# EAGLE design base-6u-custom-8535 (EAGLE 6.2)
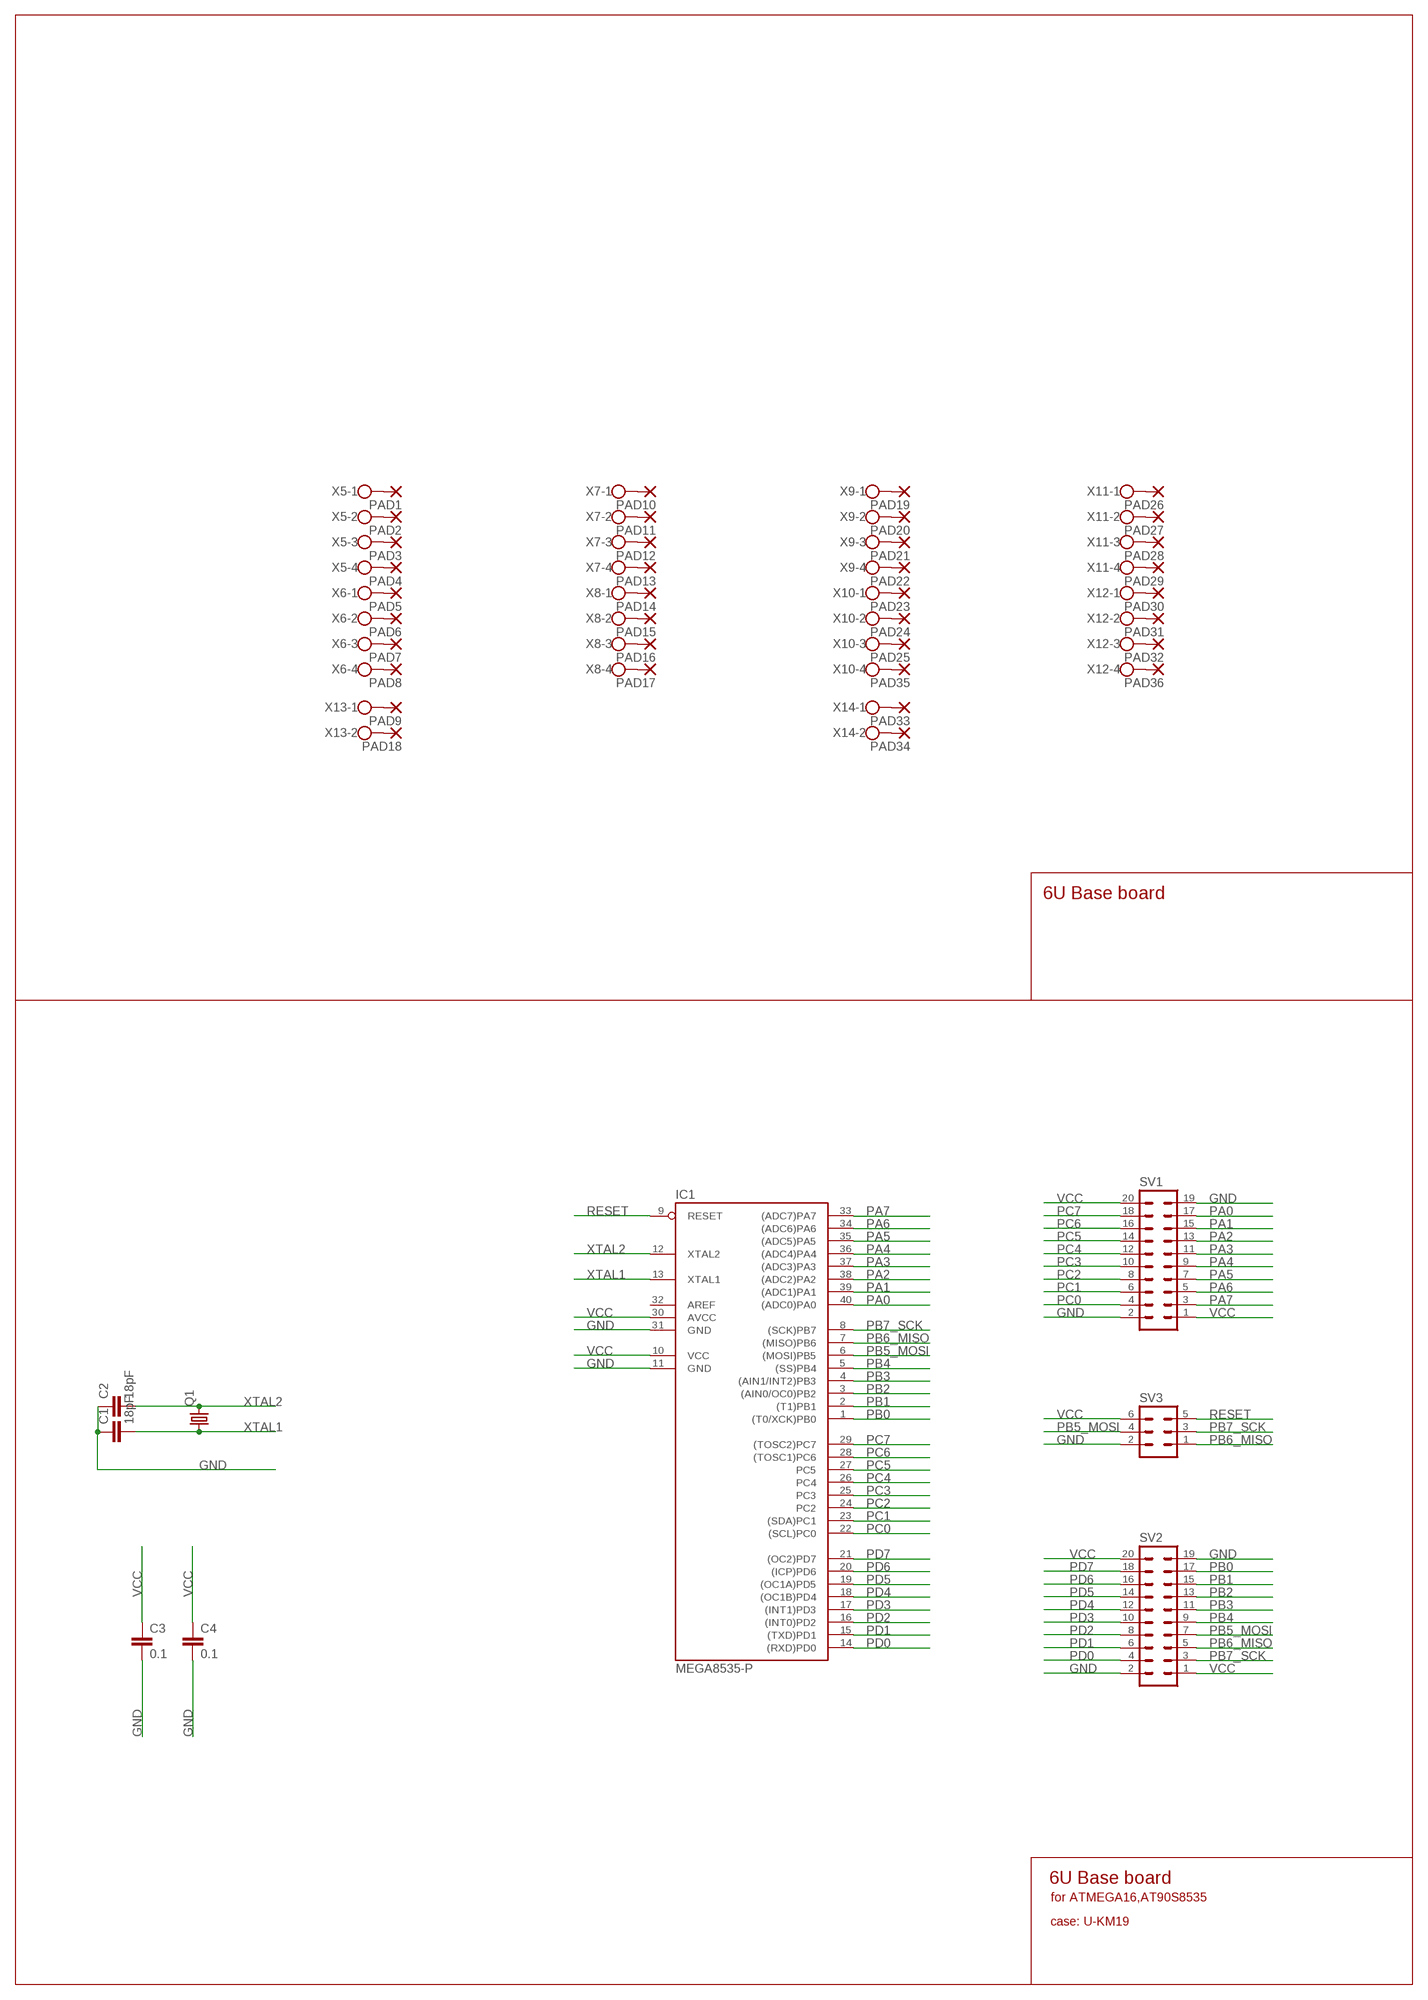
[diagram p0: schematic, sheet 1]

## Parts
C1  18pF  C-EUC0805  [C0805]
C2  18pF  C-EUC0805  [C0805]
C3  0.1  C-EUC0805  [C0805]
C4  0.1  C-EUC0805  [C0805]
IC1  MEGA8535-P  [DIL40]
PAD1  2,54/0,8  [2,54/0,8]
PAD2  2,54/0,8  [2,54/0,8]
PAD3  2,54/0,8  [2,54/0,8]
PAD4  2,54/0,8  [2,54/0,8]
PAD5  2,54/0,8  [2,54/0,8]
PAD6  2,54/0,8  [2,54/0,8]
PAD7  2,54/0,8  [2,54/0,8]
PAD8  2,54/0,8  [2,54/0,8]
PAD9  2,54/0,8  [2,54/0,8]
PAD10  2,54/0,8  [2,54/0,8]
PAD11  2,54/0,8  [2,54/0,8]
PAD12  2,54/0,8  [2,54/0,8]
PAD13  2,54/0,8  [2,54/0,8]
PAD14  2,54/0,8  [2,54/0,8]
PAD15  2,54/0,8  [2,54/0,8]
PAD16  2,54/0,8  [2,54/0,8]
PAD17  2,54/0,8  [2,54/0,8]
PAD18  2,54/0,8  [2,54/0,8]
PAD19  2,54/0,8  [2,54/0,8]
PAD20  2,54/0,8  [2,54/0,8]
PAD21  2,54/0,8  [2,54/0,8]
PAD22  2,54/0,8  [2,54/0,8]
PAD23  2,54/0,8  [2,54/0,8]
PAD24  2,54/0,8  [2,54/0,8]
PAD25  2,54/0,8  [2,54/0,8]
PAD26  2,54/0,8  [2,54/0,8]
PAD27  2,54/0,8  [2,54/0,8]
PAD28  2,54/0,8  [2,54/0,8]
PAD29  2,54/0,8  [2,54/0,8]
PAD30  2,54/0,8  [2,54/0,8]
PAD31  2,54/0,8  [2,54/0,8]
PAD32  2,54/0,8  [2,54/0,8]
PAD33  2,54/0,8  [2,54/0,8]
PAD34  2,54/0,8  [2,54/0,8]
PAD35  2,54/0,8  [2,54/0,8]
PAD36  2,54/0,8  [2,54/0,8]
Q1  CRYSTALHC49S  [HC49/S]
SV1  MA10-2  [MA10-2]
SV2  MA10-2  [MA10-2]
SV3  MA03-2  [MA03-2]
X5  W237-4  [W237-4]
X6  W237-4  [W237-4]
X7  W237-4  [W237-4]
X8  W237-4  [W237-4]
X9  W237-4  [W237-4]
X10  W237-4  [W237-4]
X11  W237-4  [W237-4]
X12  W237-4  [W237-4]
X13  W237-102  [W237-102]
X14  W237-102  [W237-102]

## Nets
GND: C1.1 C2.1 C3.2 C4.2 IC1.11(GND) IC1.31(GND) SV1.2 SV1.19 SV2.2 SV2.19 SV3.2
N$1: PAD1.1(P) X5.1
N$2: PAD2.1(P) X5.2
N$3: PAD3.1(P) X5.3
N$4: PAD4.1(P) X5.4
N$5: PAD5.1(P) X6.1
N$6: PAD6.1(P) X6.2
N$7: PAD7.1(P) X6.3
N$8: PAD8.1(P) X6.4
N$9: PAD9.1(P) X13.1
N$10: PAD10.1(P) X7.1
N$11: PAD11.1(P) X7.2
N$12: PAD12.1(P) X7.3
N$13: PAD13.1(P) X7.4
N$14: PAD14.1(P) X8.1
N$15: PAD15.1(P) X8.2
N$16: PAD16.1(P) X8.3
N$17: PAD17.1(P) X8.4
N$18: PAD18.1(P) X13.2
N$19: PAD26.1(P) X11.1
N$20: PAD27.1(P) X11.2
N$21: PAD28.1(P) X11.3
N$22: PAD29.1(P) X11.4
N$23: PAD30.1(P) X12.1
N$24: PAD31.1(P) X12.2
N$25: PAD32.1(P) X12.3
N$26: PAD19.1(P) X9.1
N$27: PAD20.1(P) X9.2
N$28: PAD21.1(P) X9.3
N$29: PAD22.1(P) X9.4
N$30: PAD23.1(P) X10.1
N$31: PAD24.1(P) X10.2
N$32: PAD25.1(P) X10.3
N$33: PAD35.1(P) X10.4
N$34: PAD36.1(P) X12.4
N$35: PAD33.1(P) X14.1
N$36: PAD34.1(P) X14.2
PA0: IC1.40((ADC0)PA0) SV1.17
PA1: IC1.39((ADC1)PA1) SV1.15
PA2: IC1.38((ADC2)PA2) SV1.13
PA3: IC1.37((ADC3)PA3) SV1.11
PA4: IC1.36((ADC4)PA4) SV1.9
PA5: IC1.35((ADC5)PA5) SV1.7
PA6: IC1.34((ADC6)PA6) SV1.5
PA7: IC1.33((ADC7)PA7) SV1.3
PB0: IC1.1((T0/XCK)PB0) SV2.17
PB1: IC1.2((T1)PB1) SV2.15
PB2: IC1.3((AIN0/OC0)PB2) SV2.13
PB3: IC1.4((AIN1/INT2)PB3) SV2.11
PB4: IC1.5((SS)PB4) SV2.9
PB5_MOSI: IC1.6((MOSI)PB5) SV2.7 SV3.4
PB6_MISO: IC1.7((MISO)PB6) SV2.5 SV3.1
PB7_SCK: IC1.8((SCK)PB7) SV2.3 SV3.3
PC0: IC1.22((SCL)PC0) SV1.4
PC1: IC1.23((SDA)PC1) SV1.6
PC2: IC1.24(PC2) SV1.8
PC3: IC1.25(PC3) SV1.10
PC4: IC1.26(PC4) SV1.12
PC5: IC1.27(PC5) SV1.14
PC6: IC1.28((TOSC1)PC6) SV1.16
PC7: IC1.29((TOSC2)PC7) SV1.18
PD0: IC1.14((RXD)PD0) SV2.4
PD1: IC1.15((TXD)PD1) SV2.6
PD2: IC1.16((INT0)PD2) SV2.8
PD3: IC1.17((INT1)PD3) SV2.10
PD4: IC1.18((OC1B)PD4) SV2.12
PD5: IC1.19((OC1A)PD5) SV2.14
PD6: IC1.20((ICP)PD6) SV2.16
PD7: IC1.21((OC2)PD7) SV2.18
RESET: IC1.9(RESET) SV3.5
VCC: C3.1 C4.1 IC1.10(VCC) IC1.30(AVCC) SV1.1 SV1.20 SV2.1 SV2.20 SV3.6
XTAL1: C1.2 IC1.13(XTAL1) Q1.1
XTAL2: C2.2 IC1.12(XTAL2) Q1.2
Unconnected: IC1.32(AREF)

## Notes on the sheet
- 6U Base board
- 6U Base board
- for ATMEGA16,AT90S8535
- case: U-KM19

## Library data of the parts
C1-C4 = rcl:C-EU: CAPACITOR, European symbol
IC1 = atmel:MEGA8535-P: MICROCONTROLLER 8 Kbytes FLASH 512 bytes SRAM 512 bytes EEPROM USART 8-channel 10 bit ADC Source: avr.lbr; MPN: ATMEGA8535-16PU; OC_FARNELL: 9171444; OC_NEWARK: 01M6909
PAD1-PAD36 = wirepad:2,54/0,8: THROUGH-HOLE PAD
Q1 = crystal:CRYSTAL: CRYSTAL
SV1 SV2 = con-lstb:MA10-2: PIN HEADER; OC_FARNELL: unknown; OC_NEWARK: unknown
SV3 = con-lstb:MA03-2: PIN HEADER; OC_FARNELL: unknown; OC_NEWARK: unknown
X5-X12 = con-wago-500:W237-4: WAGO SCREW CLAMP; OC_FARNELL: unknown; OC_NEWARK: unknown
X13 X14 = con-wago-500:W237-102: WAGO SCREW CLAMP; MPN: 237-102; OC_FARNELL: unknown; OC_NEWARK: 70K9898

## Board
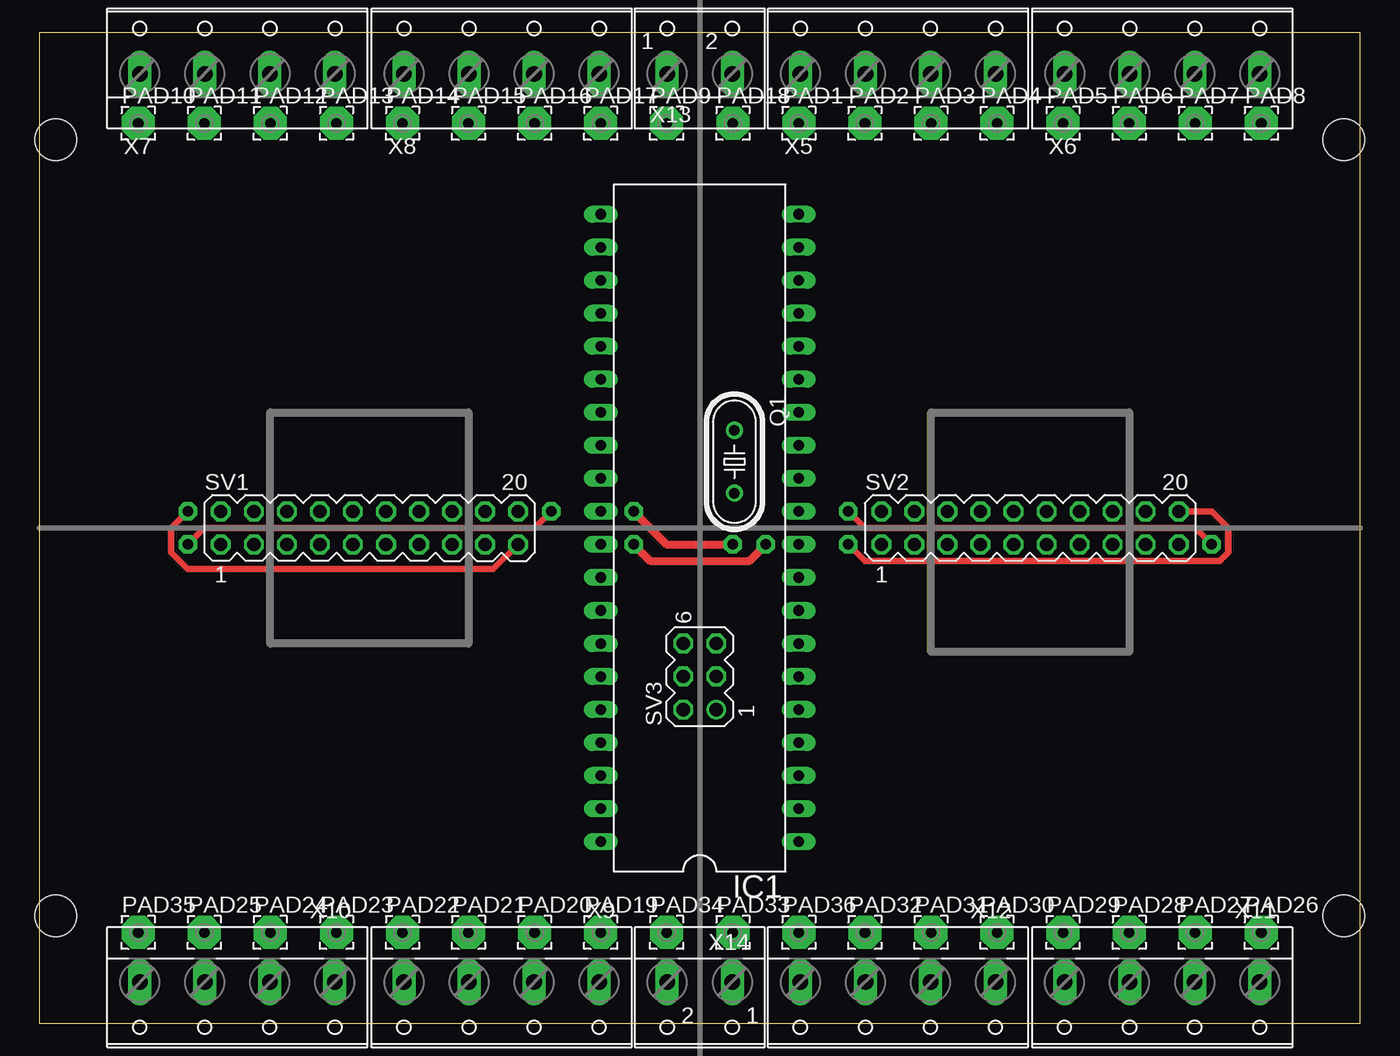
[diagram p1: board, top side]
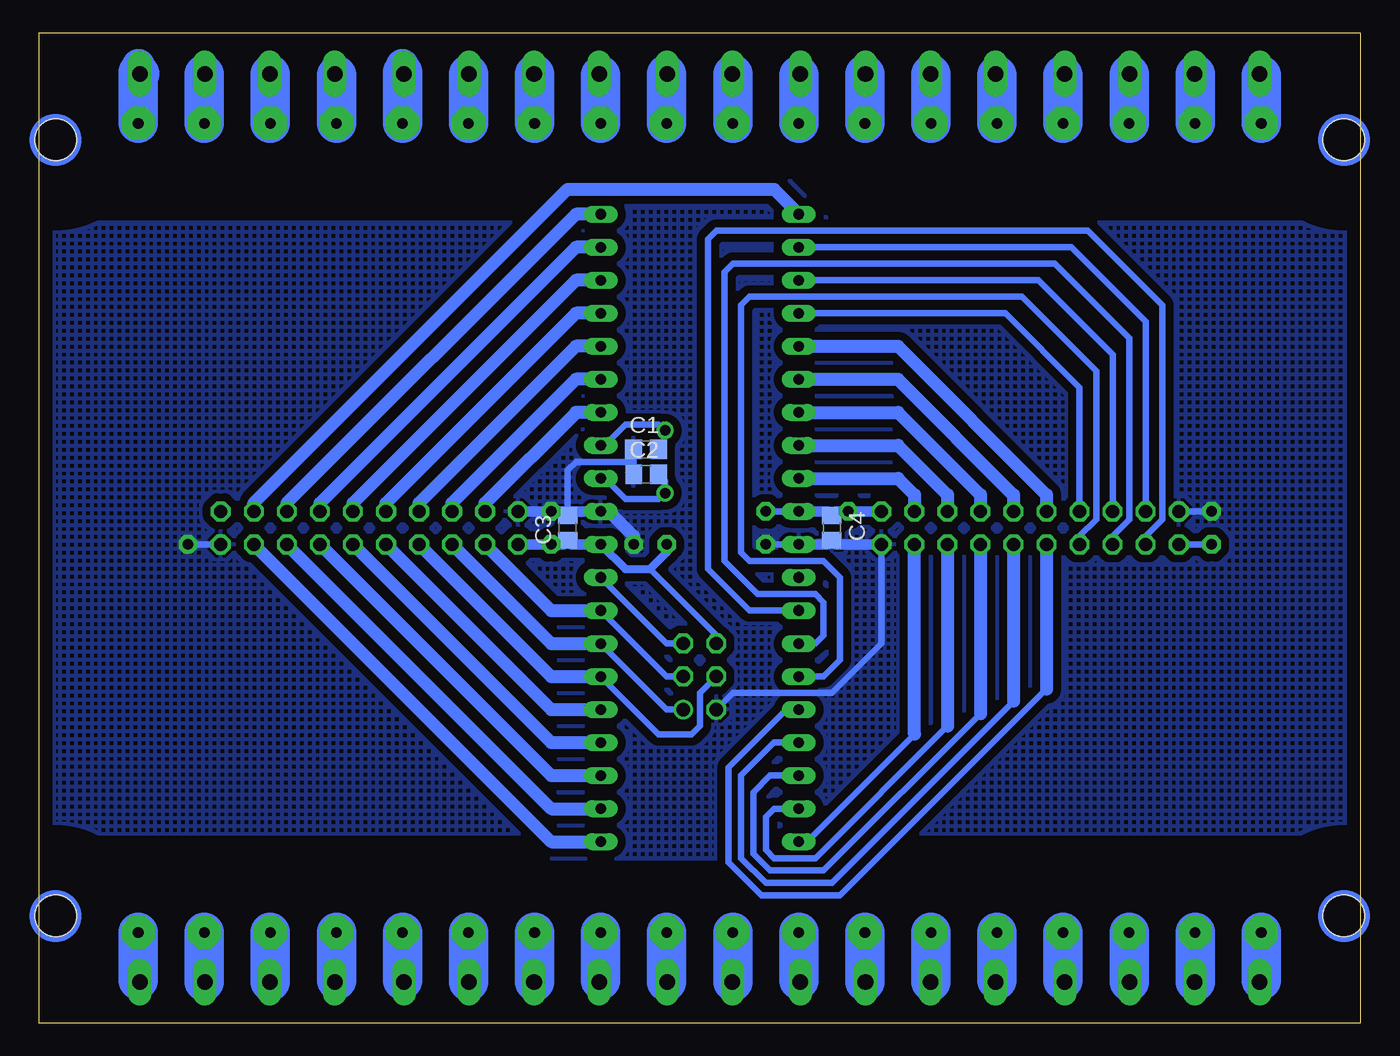
[diagram p2: board, bottom side, seen from below]

Size 101.6 x 76.2 mm. Coordinates in mm from the lower left corner, seen from the top.
Outline: 0,0 101.6,0 101.6,76.2 0,76.2 0,0
Copper layers (1*16): Top 0.035mm / dielectric 1.5mm / Bottom 0.035mm
Design rules: minimum track width 10mil, minimum drill 24mil, track to track 8mil, track to pad 8mil, pad to pad 8mil, via to via 8mil, smd to smd 8mil, copper to edge 40mil, drill to drill 8mil, minimum pad ring 10mil, minimum via ring 8mil, stop-mask expansion 4mil, vias tented up to drill 0mil, thermal gap 10mil
Holes 3.2 mm at 1.27,8.25 1.27,67.94 100.33,8.25 100.33,67.94
bRestrict: area -2.5,4.4 to 5.1,12.1; area 96.5,4.4 to 104.1,12.1; area -2.5,64.1 to 5.1,71.8; area 96.5,64.1 to 104.1,71.8

### Footprints (pad centres in the part's own frame; a part is rotated, then mirrored left to right if it is on the bottom)
C0805 = smd 1.3 x 1.5: 1 -0.95,0; 2 0.95,0
DIL40 = drill 0.813 long: 1 -24.13,-7.62; 2 -21.59,-7.62; 3 -19.05,-7.62; 4 -16.51,-7.62; 5 -13.97,-7.62; 6 -11.43,-7.62; 7 -8.89,-7.62; 8 -6.35,-7.62; 9 -3.81,-7.62; 10 -1.27,-7.62; 11 1.27,-7.62; 12 3.81,-7.62; 13 6.35,-7.62; 14 8.89,-7.62; 15 11.43,-7.62; 16 13.97,-7.62; 17 16.51,-7.62; 18 19.05,-7.62; 19 21.59,-7.62; 20 24.13,-7.62; 21 24.13,7.62; 22 21.59,7.62; 23 19.05,7.62; 24 16.51,7.62; 25 13.97,7.62; 26 11.43,7.62; 27 8.89,7.62; 28 6.35,7.62; 29 3.81,7.62; 30 1.27,7.62; 31 -1.27,7.62; 32 -3.81,7.62; 33 -6.35,7.62; 34 -8.89,7.62; 35 -11.43,7.62; 36 -13.97,7.62; 37 -16.51,7.62; 38 -19.05,7.62; 39 -21.59,7.62; 40 -24.13,7.62
2,54/0,8 = drill 0.813 pad 2.54 octagon: 1 0,0
HC49/S = drill 0.813: 1 -2.413,0; 2 2.413,0
MA10-2 = drill 1.016 octagon: 1 -11.43,-1.27; 2 -11.43,1.27; 3 -8.89,-1.27; 4 -8.89,1.27; 5 -6.35,-1.27; 6 -6.35,1.27; 7 -3.81,-1.27; 8 -3.81,1.27; 9 -1.27,-1.27; 10 -1.27,1.27; 11 1.27,-1.27; 12 1.27,1.27; 13 3.81,-1.27; 14 3.81,1.27; 15 6.35,-1.27; 16 6.35,1.27; 17 8.89,-1.27; 18 8.89,1.27; 19 11.43,-1.27; 20 11.43,1.27
MA03-2 = drill 1.016: 1 -2.54,-1.27 | drill 1.016 octagon: 2 -2.54,1.27; 3 0,-1.27; 4 0,1.27; 5 2.54,-1.27; 6 2.54,1.27
W237-4 = drill 1.194 long: 1 -7.5,-1.27; 2 -2.5,-1.27; 3 2.5,-1.27; 4 7.5,-1.27
W237-102 = drill 1.194 long: 1 -2.5,-1.27; 2 2.5,-1.27

### Placement (x,y rotation side)
C1  54.93,44.13 0 bottom
C2  54.93,42.23 0 bottom
C3  60.96,38.1 90 bottom
C4  40.64,38.1 270 bottom
IC1  50.8,38.1 90 top
PAD1  58.42,69.21 0 top
PAD2  63.5,69.21 0 top
PAD3  68.58,69.21 0 top
PAD4  73.66,69.21 0 top
PAD5  78.74,69.21 0 top
PAD6  83.82,69.21 0 top
PAD7  88.9,69.21 0 top
PAD8  93.98,69.21 0 top
PAD9  48.26,69.21 0 top
PAD10  7.62,69.21 0 top
PAD11  12.7,69.21 0 top
PAD12  17.78,69.21 0 top
PAD13  22.86,69.21 0 top
PAD14  27.94,69.21 0 top
PAD15  33.02,69.21 0 top
PAD16  38.1,69.21 0 top
PAD17  43.18,69.21 0 top
PAD18  53.34,69.21 0 top
PAD19  43.18,6.99 0 top
PAD20  38.1,6.99 0 top
PAD21  33.02,6.99 0 top
PAD22  27.94,6.99 0 top
PAD23  22.86,6.99 0 top
PAD24  17.78,6.99 0 top
PAD25  12.7,6.99 0 top
PAD26  93.98,6.99 0 top
PAD27  88.9,6.99 0 top
PAD28  83.82,6.99 0 top
PAD29  78.74,6.99 0 top
PAD30  73.66,6.99 0 top
PAD31  68.58,6.99 0 top
PAD32  63.5,6.99 0 top
PAD33  53.34,6.99 0 top
PAD34  48.26,6.99 0 top
PAD35  7.62,6.99 0 top
PAD36  58.42,6.99 0 top
Q1  53.47,43.19 270 top
SV1  25.4,38.1 0 top
SV2  76.2,38.1 0 top
SV3  50.8,26.67 90 top
X5  66.04,74.29 0 top
X6  86.36,74.29 0 top
X7  15.24,74.29 0 top
X8  35.56,74.29 0 top
X9  35.56,1.91 180 top
X10  15.24,1.91 180 top
X11  86.36,1.91 180 top
X12  66.04,1.91 180 top
X13  50.8,74.29 0 top
X14  50.8,1.91 180 top

### Tracks (layer width: path | path; a pad name or v marks a point on that pad's centre or on a via)
GND  (via drill 0.8 pad 1.42)
  Top 0.508: v11.43,39.37 10.16,38.1 10.16,36.2 11.43,34.93 34.92,34.93 SV1.19 | v62.23,39.37 63.5,38.1 88.9,38.1 v90.17,36.83
  Top 0.61: v45.72,36.83 46.99,35.56 54.61,35.56 v55.88,36.83
  Bottom 0.508: C2.1 C1.1 55.88,43.18 60.33,43.18 60.96,42.55 C3.2 | IC1.31 v45.72,36.83 | 57.78,39.37 IC1.11 | SV1.2 v11.43,39.37 | v90.17,36.83 SV2.19 | SV3.2 48.26,25.4 40.64,25.4 36.83,29.21 SV1.19
  Bottom 0.813: SV1.19 40.32,36.83 C4.2 40.96,36.83 IC1.31 | IC1.11 60.64,39.37 C3.2 61.28,39.37 v62.23,39.37 SV2.2
  Bottom 1.016: 57.78,39.37 55.88,37.47 v55.88,36.83
  pour Bottom (isolate 0.61, hatched): 0,61.6 40.64,61.6 43.81,64.77 60.96,64.77 64.14,61.6 101.6,61.6 101.6,14.61 64.14,14.61 62.23,12.7 49.53,12.7 46.99,10.16 39.37,10.16 34.92,14.61 0,14.61
N$1
  Bottom 2.54: 58.42,72.9 X5.1
  Bottom 3.048: PAD1.1 58.42,72.9
N$2
  Bottom 2.54: 63.5,72.98 X5.2
  Bottom 3.048: PAD2.1 63.5,72.98
N$3
  Bottom 2.54: 68.58,72.98 X5.3
  Bottom 3.048: PAD3.1 68.58,72.98
N$4
  Bottom 2.54: 73.66,73.66 73.66,73.14 X5.4
  Bottom 3.048: PAD4.1 73.66,73.14
N$5
  Bottom 2.54: 78.74,72.9 X6.1
  Bottom 3.048: PAD5.1 78.74,72.9
N$6
  Bottom 2.54: 83.82,72.98 X6.2
  Bottom 3.048: PAD6.1 83.82,72.98
N$7
  Bottom 2.54: 88.9,72.98 X6.3
  Bottom 3.048: PAD7.1 88.9,72.98
N$8
  Bottom 2.54: 93.98,73.66 93.98,73.14
  Bottom 3.048: PAD8.1 93.98,73.14 X6.4
N$9
  Bottom 2.54: 48.26,72.98 X13.1
  Bottom 3.048: PAD9.1 48.26,72.98
N$10
  Bottom 2.54: 7.62,72.9 X7.1
  Bottom 3.048: PAD10.1 7.62,72.9
N$11
  Bottom 2.54: 12.7,72.98 X7.2
  Bottom 3.048: PAD11.1 12.7,72.98
N$12
  Bottom 2.54: 17.78,72.98 X7.3
  Bottom 3.048: PAD12.1 17.78,72.98
N$13
  Bottom 2.54: 22.86,72.9 X7.4
  Bottom 3.048: PAD13.1 22.86,72.9
N$14
  Bottom 2.54: 27.94,72.9 X8.1
  Bottom 3.048: PAD14.1 27.94,72.9
N$15
  Bottom 2.54: 33.02,72.98 X8.2
  Bottom 3.048: PAD15.1 33.02,72.98
N$16
  Bottom 2.54: 38.1,72.98 X8.3
  Bottom 3.048: PAD16.1 38.1,72.98
N$17
  Bottom 2.54: 43.18,72.9 X8.4
  Bottom 3.048: PAD17.1 43.18,72.9
N$18
  Bottom 2.54: 53.34,72.98 X13.2
  Bottom 3.048: PAD18.1 53.34,72.98
N$19
  Bottom 2.54: 93.98,3.29 X11.1
  Bottom 3.048: PAD26.1 93.98,3.29
N$20
  Bottom 2.54: 88.9,3.21 X11.2
  Bottom 3.048: PAD27.1 88.9,3.21
N$21
  Bottom 2.54: 83.82,3.21 X11.3
  Bottom 3.048: PAD28.1 83.82,3.21
N$22
  Bottom 2.54: 78.74,3.29 X11.4
  Bottom 3.048: PAD29.1 78.74,3.29
N$23
  Bottom 2.54: 73.66,3.29 X12.1
  Bottom 3.048: PAD30.1 73.66,3.29
N$24
  Bottom 2.54: 68.58,3.21 X12.2
  Bottom 3.048: PAD31.1 68.58,3.21
N$25
  Bottom 2.54: 63.5,3.21 X12.3
  Bottom 3.048: PAD32.1 63.5,3.21
N$26
  Bottom 2.54: 43.18,3.29 X9.1
  Bottom 3.048: PAD19.1 43.18,3.29
N$27
  Bottom 2.54: 38.1,3.21 X9.2
  Bottom 3.048: PAD20.1 38.1,3.21
N$28
  Bottom 2.54: 33.02,3.21 X9.3
  Bottom 3.048: PAD21.1 33.02,3.21
N$29
  Bottom 2.54: 27.94,3.29 X9.4
  Bottom 3.048: PAD22.1 27.94,3.29
N$30
  Bottom 2.54: 22.86,3.29 X10.1
  Bottom 3.048: PAD23.1 22.86,3.29
N$31
  Bottom 2.54: 17.78,3.21 X10.2
  Bottom 3.048: PAD24.1 17.78,3.21
N$32
  Bottom 2.54: 12.7,3.21 X10.3
  Bottom 3.048: PAD25.1 12.7,3.21
N$33
  Bottom 2.54: 7.62,3.29 X10.4
  Bottom 3.048: PAD35.1 7.62,3.29
N$34
  Bottom 2.54: 58.42,3.29 X12.4
  Bottom 3.048: PAD36.1 58.42,3.29
N$35
  Bottom 2.54: X14.1 53.34,3.21
  Bottom 3.048: 53.34,3.21 PAD33.1
N$36
  Bottom 2.54: X14.2 48.26,3.21
  Bottom 3.048: 48.26,3.21 PAD34.1
PA0
  Bottom 0.508: IC1.40 42.55,13.97 34.29,22.23
  Bottom 1.016: 34.29,22.23 SV1.17
PA1
  Bottom 0.508: 31.75,22.86 41.91,12.7 45.09,12.7 45.72,13.34 45.72,15.88 45.09,16.51 IC1.39
  Bottom 1.016: SV1.15 31.75,22.86
PA2
  Bottom 0.508: 29.21,23.81 41.27,11.75 45.4,11.75 46.67,13.02 46.67,17.78 45.4,19.05 IC1.38
  Bottom 1.016: SV1.13 29.21,23.81
PA3
  Bottom 0.508: 26.67,24.77 40.64,10.8 45.72,10.8 47.62,12.7 47.62,19.05 45.09,21.59 IC1.37
  Bottom 1.016: SV1.11 26.67,24.77
PA4
  Bottom 0.508: 24.13,25.72 40.01,9.84 46.04,9.84 48.58,12.38 48.58,19.69 44.13,24.13 IC1.36
  Bottom 1.016: SV1.9 24.13,25.72
PA5
  Bottom 0.508: IC1.35 41.27,26.67 40.01,27.94 40.01,34.29 41.27,35.56 46.99,35.56 47.62,36.2 47.62,55.24 46.99,55.88 26.04,55.88 20.32,50.16 20.32,38.73 21.59,37.47 SV1.7
PA6
  Bottom 0.508: IC1.34 41.91,29.21 41.27,29.84 41.27,32.38 41.91,33.02 46.35,33.02 48.9,35.56 48.9,57.79 48.26,58.42 23.5,58.42 17.78,52.7 17.78,38.73 19.05,37.47 SV1.5
PA7
  Bottom 0.508: IC1.33 46.99,31.75 50.16,34.93 50.16,60.33 49.53,60.96 20.95,60.96 15.24,55.24 15.24,38.73 16.51,37.47 SV1.3
PB0
  Bottom 1.016: SV2.17 62.23,13.97 IC1.1
PB1
  Bottom 1.016: SV2.15 62.23,16.51 IC1.2
PB2
  Bottom 1.016: SV2.13 62.23,19.05 IC1.3
PB3
  Bottom 1.016: SV2.11 62.23,21.59 IC1.4
PB4
  Bottom 1.016: SV2.9 62.23,24.13 IC1.5
PB5_MOSI
  Bottom 0.508: IC1.6 53.98,22.23 51.44,22.23 50.8,22.86 50.8,25.4 SV3.4
  Bottom 1.016: SV2.7 62.23,26.67 IC1.6
PB6_MISO
  Bottom 0.508: IC1.7 53.34,24.13 SV3.1
  Bottom 1.016: SV2.5 62.23,29.21 IC1.7
PB7_SCK
  Bottom 0.508: IC1.8 53.34,26.67 SV3.3
  Bottom 1.016: SV2.3 62.23,31.75 IC1.8
PC0
  Bottom 0.508: IC1.22 22.23,59.69 16.51,53.98 SV1.4
PC1
  Bottom 0.508: IC1.23 24.77,57.15 19.05,51.44 SV1.6
PC2
  Bottom 0.508: IC1.24 27.3,54.61 21.59,48.9 SV1.8
PC3
  Bottom 1.016: IC1.25 35.56,52.07 24.13,40.64 SV1.10
PC4
  Bottom 1.016: IC1.26 35.56,49.53 26.67,40.64 SV1.12
PC5
  Bottom 1.016: IC1.27 35.56,46.99 29.21,40.64 SV1.14
PC6
  Bottom 1.016: IC1.28 35.56,44.45 31.75,40.64 SV1.16
PC7
  Bottom 1.016: IC1.29 35.56,41.91 34.29,40.64 SV1.18
PD0
  Bottom 1.016: IC1.14 60.33,46.99 67.31,40.01 SV2.4
PD1
  Bottom 1.016: IC1.15 60.33,49.53 69.85,40.01 SV2.6
PD2
  Bottom 1.016: IC1.16 60.33,52.07 72.39,40.01 SV2.8
PD3
  Bottom 1.016: IC1.17 60.33,54.61 74.93,40.01 SV2.10
PD4
  Bottom 1.016: IC1.18 60.33,57.15 77.47,40.01 SV2.12
PD5
  Bottom 1.016: IC1.19 60.33,59.69 80.01,40.01 SV2.14
PD6
  Bottom 1.016: IC1.20 60.33,62.23 82.55,40.01 SV2.16
PD7
  Bottom 1.016: SV2.18 85.09,40.01 60.96,64.13 45.09,64.13 IC1.21
RESET
  Bottom 0.508: IC1.9 53.34,29.21 SV3.5
VCC  (via drill 0.8 pad 1.42)
  Top 0.508: v39.37,39.37 38.1,38.1 12.7,38.1 v11.43,36.83 | v62.23,36.83 63.5,35.56 90.81,35.56 91.44,36.2 91.44,38.1 90.17,39.37 SV2.20
  Top 0.61: v45.72,39.37 48.26,36.83 v53.34,36.83
  Bottom 0.508: IC1.30 v45.72,39.37 | v11.43,36.83 SV1.1 | 54.61,34.93 49.53,29.84 SV3.6
  Bottom 0.61: IC1.10 56.52,34.93 54.61,34.93 53.34,36.2 v53.34,36.83
  Bottom 0.813: SV1.20 v39.37,39.37 40.32,39.37 C4.1 40.96,39.37 IC1.30 | IC1.10 60.64,36.83 C3.1 61.28,36.83 v62.23,36.83 SV2.1
XTAL1
  Bottom 0.508: Q1.1 53.54,45.61 | 53.54,45.61 53.98,46.04 56.52,46.04 57.78,44.77 58.1,44.77 IC1.13 | 53.54,45.61 53.54,44.57 C1.2
XTAL2
  Bottom 0.508: IC1.12 58.1,41.59 57.78,41.59 56.52,40.32 53.98,40.32 53.52,40.78 Q1.2 53.47,41.72 C2.2
(copper drawn outside any net)
  shapes: Bottom circle x4